# Altium project wootch_v_0_0.PrjPcb
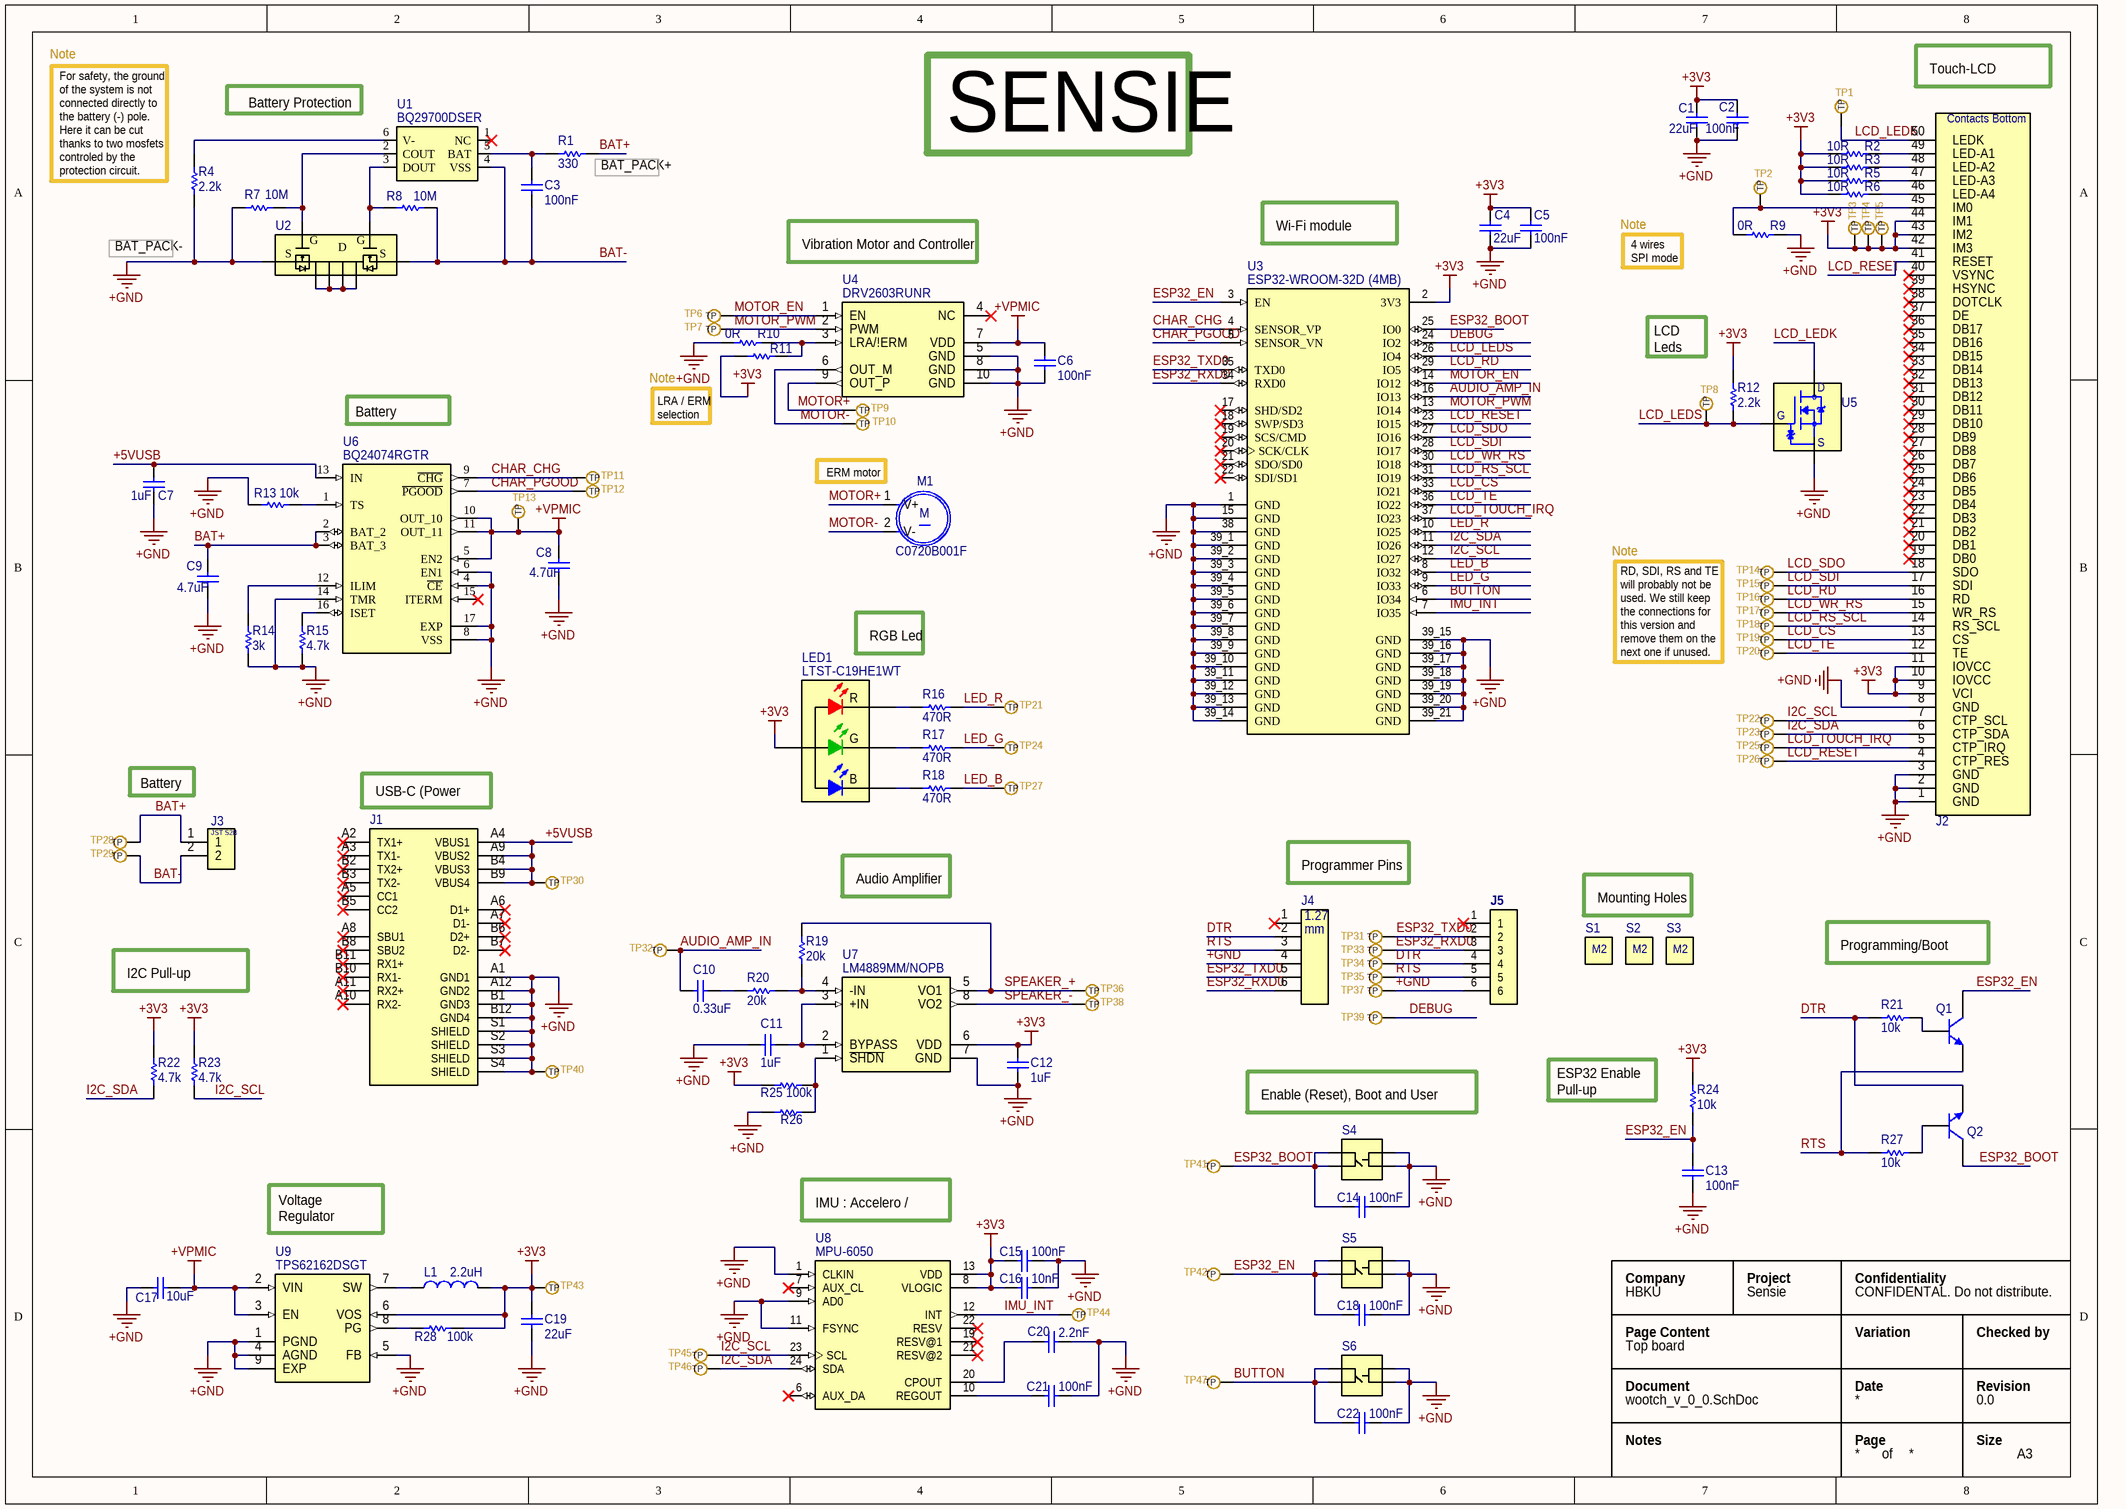
[diagram p0: wootch_v_0_0.SchDoc]
company: HBKU; page_size: A3; project: Sensie; version_revision: 0.0
1 sheet, 122 parts. Net scope: global (net labels, ports and power ports of the same name join across sheets).
Board file: wootch_v_0_0.PcbDoc

## Sheet wootch_v_0_0.SchDoc
size A3

### Parts
C1  value 22uF  [C0603]  (hidden comment: Multilayer Ceramic Capacitor)
C2  value 100nF  [C0402]  (hidden comment: Multilayer Ceramic Capacitor)
C3  value 100nF  [C0402]  (hidden comment: Multilayer Ceramic Capacitor)
C4  value 22uF  [C0603]  (hidden comment: Multilayer Ceramic Capacitor)
C5  value 100nF  [C0402]  (hidden comment: Multilayer Ceramic Capacitor)
C6  value 100nF  [C0402]  (hidden comment: Multilayer Ceramic Capacitor)
C7  value 1uF  [C0402]  (hidden comment: Multilayer Ceramic Capacitor)
C8  value 4.7uF  [C0402]  (hidden comment: Multilayer Ceramic Capacitor)
C9  value 4.7uF  [C0402]  (hidden comment: Multilayer Ceramic Capacitor)
C10  value 0.33uF  [C0402]  (hidden comment: Multilayer Ceramic Capacitor)
C11  value 1uF  [C0402]  (hidden comment: Multilayer Ceramic Capacitor)
C12  value 1uF  [C0402]  (hidden comment: Multilayer Ceramic Capacitor)
C13  value 100nF  [C0402]  (hidden comment: Multilayer Ceramic Capacitor)
C14  value 100nF  [C0402]  (hidden comment: Multilayer Ceramic Capacitor)
C15  value 100nF  [C0402]  (hidden comment: Multilayer Ceramic Capacitor)
C16  value 10nF  [C0402]  (hidden comment: Multilayer Ceramic Capacitor)
C17  value 10uF  [C0402]  (hidden comment: Multilayer Ceramic Capacitor)
C18  value 100nF  [C0402]  (hidden comment: Multilayer Ceramic Capacitor)
C19  value 22uF  [C0603]  (hidden comment: Multilayer Ceramic Capacitor)
C20  value 2.2nF  [C0402]  (hidden comment: Multilayer Ceramic Capacitor)
C21  value 100nF  [C0402]  (hidden comment: Multilayer Ceramic Capacitor)
C22  value 100nF  [C0402]  (hidden comment: Multilayer Ceramic Capacitor)
J1  1054500101  [USB-C-1054500101]  (value not drawn)
J2  FPC-50-screen-connector-bottom-62684-501100ALF  [FPC-50-62684-501100ALF]  (value not drawn)
J3  S2B-PH-K-S(LF)(SN)  [S2B-PH-K-S(LF)(SN)]  (value not drawn)
J4  FTS-103-01-F-DV-TR  [CON_6_2_1.27_FTS_103_01]  (value not drawn)
J5  Plug of Nails 6 pins  [PLUG-OF-NAILS-6-PIN]  (value not drawn)
L1  value 2.2uH  [L0603]  (hidden comment: IND 2.2uH 0603)
LED1  Manufacturer Part Number: LTST-C19HE1WT  [LTST-C19HE1WT-4_V]  (hidden comment: rgb_LTST-C19HE1WT)
M1  C0720B001F  [C0720B001F]
Q1  MMBT2222ALT1G  [ONSC-SOT-23-3-318-08_V]  (value not drawn)
Q2  MMBT2222ALT1G  [ONSC-SOT-23-3-318-08_V]  (value not drawn)
R1  value 330  [R0402]  (hidden comment: Thick Film)
R2  value 10R  [R0402]  (hidden comment: Thick Film)
R3  value 10R  [R0402]  (hidden comment: Thick Film)
R4  value 2.2k  [R0402]  (hidden comment: Thick Film)
R5  value 10R  [R0402]  (hidden comment: Thick Film)
R6  value 10R  [R0402]  (hidden comment: Thick Film)
R7  value 10M  [R0402]  (hidden comment: Thick Film)
R8  value 10M  [R0402]  (hidden comment: Thick Film)
R9  value 0R  [R0402]  (hidden comment: Thick Film)
R10  value 0R  [R0402]  (hidden comment: Thick Film)
R11  Thick Film  [R0402_DNI]  (value not drawn)
R12  value 2.2k  [R0402]  (hidden comment: Thick Film)
R13  value 10k  [R0402]  (hidden comment: Thick Film)
R14  value 3k  [R0402]  (hidden comment: Thick Film)
R15  value 4.7k  [R0402]  (hidden comment: Thick Film)
R16  value 470R  [R0402]  (hidden comment: Thick Film)
R17  value 470R  [R0402]  (hidden comment: Thick Film)
R18  value 470R  [R0402]  (hidden comment: Thick Film)
R19  value 20k  [R0402]  (hidden comment: Thick Film)
R20  value 20k  [R0402]  (hidden comment: Thick Film)
R21  value 10k  [R0402]  (hidden comment: Thick Film)
R22  value 4.7k  [R0402]  (hidden comment: Thick Film)
R23  value 4.7k  [R0402]  (hidden comment: Thick Film)
R24  value 10k  [R0402]  (hidden comment: Thick Film)
R25  value 100k  [R0402]  (hidden comment: Thick Film)
R26  Thick Film  [R0402_DNI]  (value not drawn)
R27  value 10k  [R0402]  (hidden comment: Thick Film)
R28  value 100k  [R0402]  (hidden comment: Thick Film)
S1  hole_M2  [M2_no_screw]  (value not drawn)
S2  hole_M2  [M2_no_screw]  (value not drawn)
S3  hole_M2  [M2_no_screw]  (value not drawn)
S4  TL1014BF160QG  [BUTTON_TL1014BF160QG]  (value not drawn)
S5  TL1014BF160QG  [BUTTON_TL1014BF160QG]  (value not drawn)
S6  TL1014BF160QG  [BUTTON_TL1014BF160QG]  (value not drawn)
TP1  TP_1mm  [TP_1mm]  (value not drawn)
TP2  TP_1mm  [TP_1mm]  (value not drawn)
TP3  TP_1mm  [TP_1mm]  (value not drawn)
TP4  TP_1mm  [TP_1mm]  (value not drawn)
TP5  TP_1mm  [TP_1mm]  (value not drawn)
TP6  TP_1mm  [TP_1mm]  (value not drawn)
TP7  TP_1mm  [TP_1mm]  (value not drawn)
TP8  TP_1mm  [TP_1mm]  (value not drawn)
TP9  TP_2mm  [TP_2mm]  (value not drawn)
TP10  TP_2mm  [TP_2mm]  (value not drawn)
TP11  TP_1mm  [TP_1mm]  (value not drawn)
TP12  TP_1mm  [TP_1mm]  (value not drawn)
TP13  TP_1mm  [TP_1mm]  (value not drawn)
TP14  TP_1mm  [TP_1mm]  (value not drawn)
TP15  TP_1mm  [TP_1mm]  (value not drawn)
TP16  TP_1mm  [TP_1mm]  (value not drawn)
TP17  TP_1mm  [TP_1mm]  (value not drawn)
TP18  TP_1mm  [TP_1mm]  (value not drawn)
TP19  TP_1mm  [TP_1mm]  (value not drawn)
TP20  TP_1mm  [TP_1mm]  (value not drawn)
TP21  TP_1mm  [TP_1mm]  (value not drawn)
TP22  TP_1mm  [TP_1mm]  (value not drawn)
TP23  TP_1mm  [TP_1mm]  (value not drawn)
TP24  TP_1mm  [TP_1mm]  (value not drawn)
TP25  TP_1mm  [TP_1mm]  (value not drawn)
TP26  TP_1mm  [TP_1mm]  (value not drawn)
TP27  TP_1mm  [TP_1mm]  (value not drawn)
TP28  TP_3mm  [TP_3mm]  (value not drawn)
TP29  TP_3mm  [TP_3mm]  (value not drawn)
TP30  TP_1mm  [TP_1mm]  (value not drawn)
TP31  TP_2mm  [TP_2mm]  (value not drawn)
TP32  TP_1mm  [TP_1mm]  (value not drawn)
TP33  TP_2mm  [TP_2mm]  (value not drawn)
TP34  TP_2mm  [TP_2mm]  (value not drawn)
TP35  TP_2mm  [TP_2mm]  (value not drawn)
TP36  TP_2mm  [TP_2mm]  (value not drawn)
TP37  TP_2mm  [TP_2mm]  (value not drawn)
TP38  TP_2mm  [TP_2mm]  (value not drawn)
TP39  TP_2mm  [TP_2mm]  (value not drawn)
TP40  TP_1mm  [TP_1mm]  (value not drawn)
TP41  TP_1mm  [TP_1mm]  (value not drawn)
TP42  TP_1mm  [TP_1mm]  (value not drawn)
TP43  TP_1mm  [TP_1mm]  (value not drawn)
TP44  TP_1mm  [TP_1mm]  (value not drawn)
TP45  TP_1mm  [TP_1mm]  (value not drawn)
TP46  TP_1mm  [TP_1mm]  (value not drawn)
TP47  TP_1mm  [TP_1mm]  (value not drawn)
U1  BQ29700DSER  [BATT_PROTEC_BQ29700DSER]
U2  ECH8693R-TL-W  [MOSFET_2CHAN_ECH8693R-TL-W]  (value not drawn)
U3  ESP32-WROOM-32D  [ESP32-WROOM-32D (4MB)]  (value not drawn)
U4  DRV2603RUNR  [MOT_DRV_DRV2603RUNR]
U5  DMG1012UW-7  [MOSFET-DMG1012UW-SOT323]  (value not drawn)
U6  BQ24074RGTR  [BATT_CHARG_BQ24074RGTR]
U7  Manufacturer Part Number: LM4889MM/NOPB  [Amp_LM4889MM]  (hidden comment: LM4889)
U8  MPU-6050  [MPU6050-ACCELERO-GYRO]
U9  TPS62162DSGT  [REG_BUCK_TPS62162DSGT]

### Nets
+3V3: C1.2 C2.2 C4.2 C5.2 C12.2 C15.1 C16.1 C19.2 J2.9(VCI) J2.10(IOVCC) J2.11(IOVCC) J2.42(IM3) J2.43(IM2) J2.44(IM1) L1.2 LED1.4(A) R2.1 R3.1 R5.1 R6.1 R11.1 R12.2 R22.2 R23.2 R24.2 R25.1 R28.2 TP3.1(TP) TP4.1(TP) TP5.1(TP) TP43.1(TP) U3.2(3V3) U7.6(VDD) U8.8(VLOGIC) U8.13(VDD) U9.6(VOS)
+GND: C1.1 C2.1 C4.1 C5.1 C6.1 C7.1 C8.1 C9.1 C11.2 C12.1 C13.1 C14.2 C15.2 C16.2 C17.1 C18.2 C19.1 C20.2 C21.2 C22.2 J1.A1(GND1) J1.A12(GND2) J1.B1(GND3) J1.B12(GND4) J1.S1(SHIELD) J1.S2(SHIELD) J1.S3(SHIELD) J1.S4(SHIELD) J2.1(GND) J2.2(GND) J2.3(GND) J2.8(GND) J4.4 J5.6 R4.1 R7.2 R9.2 R10.1 R13.2 R14.1 R15.1 R26.1 S4.1 S4.3 S5.1 S5.3 S6.1 S6.3 TP37.1(TP) TP40.1(TP) U2.1(S1) U3.1(GND) U3.15(GND) U3.38(GND) U3.39_1(GND) U3.39_2(GND) U3.39_3(GND) U3.39_4(GND) U3.39_5(GND) U3.39_6(GND) U3.39_7(GND) U3.39_8(GND) U3.39_9(GND) U3.39_10(GND) U3.39_11(GND) U3.39_12(GND) U3.39_13(GND) U3.39_14(GND) U3.39_15(GND) U3.39_16(GND) U3.39_17(GND) U3.39_18(GND) U3.39_19(GND) U3.39_20(GND) U3.39_21(GND) U4.5(GND) U4.8(GND) U4.10(GND) U5.3(S) U6.4(~{CE}) U6.6(EN1) U6.8(VSS) U6.14(TMR) U6.17(EXP) U7.7(GND) U8.1(CLKIN) U8.9(AD0) U8.11(FSYNC) U9.1(PGND) U9.4(AGND) U9.5(FB) U9.9(EXP)
+VPMIC: C6.2 C8.2 C17.2 TP13.1(TP) U4.7(VDD) U6.5(EN2) U6.10(OUT_10) U6.11(OUT_11) U9.2(VIN) U9.3(EN)
+5VUSB: C7.2 J1.A4(VBUS1) J1.A9(VBUS2) J1.B4(VBUS3) J1.B9(VBUS4) TP30.1(TP) U6.13(IN)
AUDIO_AMP_IN: C10.1 TP32.1(TP) U3.16(IO13)
BAT+: C9.2 J3.1 R1.2 TP28.1(TP) U6.2(BAT_2) U6.3(BAT_3)
BAT-: C3.1 J3.2 R8.1 TP29.1(TP) U1.4(VSS) U2.3(S2)
BUTTON: C22.1 S6.2 S6.4 TP47.1(TP) U3.6(IO34)
CHAR_CHG: TP11.1(TP) U3.4(SENSOR_VP) U6.9(~{CHG})
CHAR_PGOOD: TP12.1(TP) U3.5(SENSOR_VN) U6.7(~{PGOOD})
DEBUG: TP39.1(TP) U3.24(IO2)
DTR: J4.2 J5.4 Q2.2(E) R21.1 TP34.1(TP)
ESP32_BOOT: C14.1 Q2.3(C) S4.2 S4.4 TP41.1(TP) U3.25(IO0)
ESP32_EN: C13.2 C18.1 Q1.3(C) R24.1 S5.2 S5.4 TP42.1(TP) U3.3(EN)
ESP32_RXD0: J4.6 J5.3 TP33.1(TP) U3.34(RXD0)
ESP32_TXD0: J4.5 J5.2 TP31.1(TP) U3.35(TXD0)
I2C_SCL: J2.7(CTP_SCL) R23.1 TP22.1(TP) TP45.1(TP) U3.12(IO27) U8.23(SCL)
I2C_SDA: J2.6(CTP_SDA) R22.1 TP23.1(TP) TP46.1(TP) U3.11(IO26) U8.24(SDA)
IMU_INT: TP44.1(TP) U3.7(IO35) U8.12(INT)
LCD_CS: J2.13(CS) TP19.1(TP) U3.33(IO21)
LCD_LEDK: J2.50(LEDK) TP1.1(TP) U5.1(D)
LCD_LEDS: R12.1 TP8.1(TP) U3.26(IO4) U5.2(G)
LCD_RD: J2.16(RD) TP16.1(TP) U3.29(IO5)
LCD_RESET: J2.4(CTP_RES) J2.41(RESET) TP26.1(TP) U3.23(IO15)
LCD_RS_SCL: J2.14(RS_SCL) TP18.1(TP) U3.31(IO19)
LCD_SDI: J2.17(SDI) TP15.1(TP) U3.28(IO17)
LCD_SDO: J2.18(SDO) TP14.1(TP) U3.27(IO16)
LCD_TE: J2.12(TE) TP20.1(TP) U3.36(IO22)
LCD_TOUCH_IRQ: J2.5(CTP_IRQ) TP25.1(TP) U3.37(IO23)
LCD_WR_RS: J2.15(WR_RS) TP17.1(TP) U3.30(IO18)
LED_B: R18.2 TP27.1(TP) U3.8(IO32)
LED_G: R17.2 TP24.1(TP) U3.9(IO33)
LED_R: R16.2 TP21.1(TP) U3.10(IO25)
MOTOR+: M1.1(V+) TP9.1(TP) U4.9(OUT_P)
MOTOR-: M1.2(V-) TP10.1(TP) U4.6(OUT_M)
MOTOR_EN: TP6.1(TP) U3.14(IO12) U4.1(EN)
MOTOR_PWM: TP7.1(TP) U3.13(IO14) U4.2(PWM)
RTS: J4.3 J5.5 Q1.2(E) R27.1 TP35.1(TP)
SPEAKER_+: R19.2 TP36.1(TP) U7.5(VO1)
SPEAKER_-: TP38.1(TP) U7.8(VO2)
NetC3_2: C3.2 R1.1 U1.5(BAT)
NetC10_2: C10.2 R20.1
NetC11_1: C11.1 U7.2(BYPASS) U7.3(+IN)
NetC20_1: C20.1 U8.20(CPOUT)
NetC21_1: C21.1 U8.10(REGOUT)
NetJ2_45: J2.45(IM0) R9.1 TP2.1(TP)
NetJ2_46: J2.46(LED-A4) R6.2
NetJ2_47: J2.47(LED-A3) R5.2
NetJ2_48: J2.48(LED-A2) R3.2
NetJ2_49: J2.49(LED-A1) R2.2
NetL1_1: L1.1 U9.7(SW)
NetLED1_1: LED1.1(R) R16.1
NetLED1_2: LED1.2(G) R17.1
NetLED1_3: LED1.3(B) R18.1
NetQ1_1: Q1.1(B) R21.2
NetQ2_1: Q2.1(B) R27.2
NetR4_2: R4.2 U1.6(V-)
NetR7_1: R7.1 U1.2(COUT) U2.2(G1)
NetR8_2: R8.2 U1.3(DOUT) U2.4(G2)
NetR10_2: R10.2 R11.2 U4.3(LRA/!ERM)
NetR13_1: R13.1 U6.1(TS)
NetR14_2: R14.2 U6.12(ILIM)
NetR15_2: R15.2 U6.16(ISET)
NetR19_1: R19.1 R20.2 U7.4(-IN)
NetR25_2: R25.2 R26.2 U7.1(~{SHDN})
NetR28_1: R28.1 U9.8(PG)
NetU2_5: U2.5(D) U2.6(D) U2.7(D) U2.8(D)

Not connected (* = marked no-connect by the designer): J1 A2(TX1+)* A3(TX1-)* A5(CC1)* A6(D1+)* A7(D1-)* A8(SBU1)* A10(RX2-)* A11(RX2+)* B2(TX2+)* B3(TX2-)* B5(CC2)* B6(D2+)* B7(D2-)* B8(SBU2)* B10(RX1-)* B11(RX1+)*; J2 19(DB0)* 20(DB1)* 21(DB2)* 22(DB3)* 23(DB4)* 24(DB5)* 25(DB6)* 26(DB7)* 27(DB8)* 28(DB9)* 29(DB10)* 30(DB11)* 31(DB12)* 32(DB13)* 33(DB14)* 34(DB15)* 35(DB16)* 36(DB17)* 37(DE)* 38(DOTCLK)* 39(HSYNC)* 40(VSYNC)*; J4 1*; J5 1*; U1 1(NC)*; U3 17(SHD/SD2)* 18(SWP/SD3)* 19(SCS/CMD)* 20(SCK/CLK)* 21(SDO/SD0)* 22(SDI/SD1)*; U4 4(NC)*; U6 15(ITERM)*; U8 6(AUX_DA)* 7(AUX_CL)* 19(RESV@1)* 21(RESV@2)* 22(RESV)*

### Notes on the sheet
- Note
- Battery Protection
- Touch-LCD connector
- (near R4) For safety, the ground of the system is not connected directly to the battery (-) pole. Here it can be cut thanks to two mosfets controled by the protection circuit.
- (near R1) BAT_PACK+
- SENSIE
- Vibration Motor and Controller
- Wi-Fi module ESP32
- BAT_PACK-
- 4 wires
  SPI mode
- LCD Leds
  Driver
- Battery Charger
- LRA / ERM selection
- ERM motor
- RGB Led
- RD, SDI, RS and TE will probably not be used. We still keep the connections for this version and remove them on the next one if unused.
- Battery
- (near J1) USB-C (Power Only)
- Audio Amplifier
- Programmer Pins
- Mounting Holes
- I2C Pull-up Resistors
- Programming/Boot Logic
- Enable (Reset), Boot and User Buttons
- (near R24) ESP32 Enable
  Pull-up Resistors
- Voltage Regulator
  3.3V BUCK
- IMU : Accelero / Gyro
- Company
- Project
- CONFIDENTAL. Do not distribute.
- Confidentiality
- Page Content
- Document
- Top board
- Variation
- Date
- Checked by
- Revision
- Notes
- Page
- of
- Size
- (in symbol C0720B001F) M
- (in symbol ECH8693R-TL-W) G; S
- (in symbol FPC-50-screen-connector-bottom-62684-501100ALF) Contacts Bottom
- (in symbol FTS-103-01-F-DV-TR) 1.27; mm
- (in symbol hole_M2) M2
- (in symbol S2B-PH-K-S(LF)(SN)) JST S2B

### Library data of the parts
C1 C4 C19 = CAP 22uF 0603: CAP CER 22UF 6.3V X5R 0603; Manufacturer Part Number: GRM188R60J226MEA0D; Manufacturer: Murata Electronics; Supplier Part Number: 490-7611-1-ND; Voltage Rating: 6.3V; Package: 0603; Link: https://www.digikey.com/product-detail/en/murata-electronics/GRM188R60J226MEA0D/490-7611-1-ND/4280544; Supplier: Digikey
C2 C3 C5 C6 C13-C15 C18 C21 C22 = CAP 100nF 0402: CAP CER 0.1UF 16V X7R 0402; Manufacturer Part Number: GRM155R71C104KA88J; Manufacturer: Murata Electronics; Supplier Part Number: 490-6328-1-ND; Voltage Rating: 16V; Package: 0402; Link: https://www.digikey.com/product-detail/en/murata-electronics/GRM155R71C104KA88J/490-6328-1-ND/3845525; Supplier: Digikey
C7 C11 C12 = CAP 1uF 0402: CAP CER 1UF 10V X6S 0402; Manufacturer Part Number: GRM155C81A105KA12D; Manufacturer: Murata Electronics; Supplier Part Number: 490-12699-1-ND; Voltage Rating: 10V; Package: 0402; Link: https://www.digikey.com/product-detail/en/murata-electronics/GRM155C81A105KA12D/490-12699-1-ND/5797668; Supplier: Digikey
C8 C9 = CAP 4.7uF 0402: CAP CER 4.7UF 6.3V X5R 0402; Manufacturer Part Number: GRM155R60J475ME47D; Manufacturer: Murata Electronics; Supplier Part Number: 490-5915-1-ND; Voltage Rating: 6.3V; Package: 0402; Link: https://www.digikey.com/product-detail/en/murata-electronics/GRM155R60J475ME47D/490-5915-1-ND/3719860; Supplier: Digikey
C10 = CAP 0.33uF 0402: CAP CER 0.33UF 10V X6S 0402; Manufacturer Part Number: GRM155R61A334KE15D; Manufacturer: Murata Electronics; Supplier Part Number: 490-3263-1-ND; Voltage Rating: 10V; Package: 0402; Link: https://www.digikey.com/en/products/detail/murata-electronics/GRM155R61A334KE15D/702527; Supplier: Digikey
C16 = CAP 10nF 0402: CAP CER 10nF 16V X7R 0402; Manufacturer Part Number: GCM155R71H103KA55D; Manufacturer: Murata Electronics; Supplier Part Number: 490-4762-1-ND; Voltage Rating: 16V; Package: 0402; Link: https://www.digikey.com/en/products/detail/murata-electronics/GCM155R71H103KA55D/1641636; Supplier: Digikey
C17 = CAP 10uF 0402: CAP CER 10UF 4V X5R 0402; Manufacturer Part Number: GRM155R60G106ME44D; Manufacturer: Murata Electronics; Supplier Part Number: 490-10693-1-ND; Voltage Rating: 4V; Package: 0402; Link: https://www.digikey.com/product-detail/en/murata-electronics/GRM155R60G106ME44D/490-10693-1-ND/5251412; Supplier: Digikey
C20 = CAP 2.2nF 0402: CAP CER 2.2nF 16V X7R 0402; Manufacturer Part Number: GCM155R72A222KA37D; Manufacturer: Murata Electronics; Supplier Part Number: 490-4911-1-ND; Voltage Rating: 16V; Package: 0402; Link: https://www.digikey.com/en/products/detail/murata-electronics/GCM155R72A222KA37D/1765159; Supplier: Digikey
J1 = 1054500101: USB-C CONN RCP USB3.1 TYPEC 24P SMD RA; Manufacturer: Molex; zz Current Rating Per Pin: 0.25A, 1A, 5A; Supplier Part Number: WM12856CT-ND; Link: https://www.digikey.com/en/products/detail/molex/1054500101/5843890; Manufacturer Part Number: 1054500101; Supplier: Digikey; Price 1000+ Units USD: 2.19; Price 1 Unit USD: 1.10
J2 = FPC-50-screen-connector-bottom-62684-501100ALF: FPC CONN BOTTOM 50POS 0.50MM R/A; Manufacturer: Amphenol ICC (FCI); zz Current Rating Per Pin: 0.5A; Supplier Part Number: 609-1197-1-ND; Link: https://www.digikey.com/en/products/detail/amphenol-icc-fci/62684-501100ALF/1001511; Manufacturer Part Number: 62684-501100ALF; Supplier: Digikey; Price 1000+ Units USD: 0.48; Price 1 Unit USD: 0.88
J3 = S2B-PH-K-S(LF)(SN): JST 2mm CONN HEADER R/A 2POS; Manufacturer: JST Sales America Inc.; Supplier Part Number: 455-1719-ND; Link: https://www.digikey.com/en/products/detail/jst-sales-america-inc/S2B-PH-K-S-LF-SN/926626; Manufacturer Part Number: S2B-PH-K-S(LF)(SN); Supplier: Digikey; Price 1000+ Units USD: 0.07; Price 1 Unit USD: 0.17
J4 = FTS-103-01-F-DV-TR: CONN HEADER SMD 6POS 1.27MM; Manufacturer: Samtec Inc.; zz Current Rating Per Pin: 3.4A; Supplier Part Number: SAM14930CT-ND; Link: https://www.digikey.com/en/products/detail/samtec-inc/FTS-103-01-F-DV-TR/2649936; Manufacturer Part Number: FTS-103-01-F-DV-TR; Supplier: Digikey; Price 1000+ Units USD: 0.78; Price 1 Unit USD: 1.39
J5 = Plug of Nails 6 pins: CBL PLUG-OF-NAILS 6-PIN with NO ATTACHMENT holes (contrary to the digikey link); Manufacturer: Tag-Connect LLC; Manufacturer Part Number: TC2030-CTX; Link: https://www.digikey.co.uk/product-detail/en/tag-connect-llc/TC2030-CTX/TC2030-CTX-ND/5023324; Supplier Part Number: TC2030-CTX-ND; Supplier: Digikey; Price 1000+ Units USD: 0; Price 1 Unit USD: 0
L1 = IND 2.2uH 0603: 2.2UH20% 1.05A(MAX) / 1.15A(TYP.; Manufacturer: Murata Electronics; Manufacturer Part Number: LQM18PN2R2MGHD; Tolerance: 20%; Supplier Part Number: 490-14478-6-ND; Package: 0603; Link: https://www.digikey.co.uk/product-detail/en/murata-electronics/LQM18PN2R2MGHD/490-14478-6-ND/6607082; Supplier: Digikey
LED1 = rgb_LTST-C19HE1WT: LED RGB DIFFUSED CHIP SMD / LED Tri-Color Blue/Green/Red, 5 V, -20 to 80 degC, 4-Pin SMD, RoHS, Tape and Reel; Manufacturer: Lite-On Inc.; zz Package: 0606; zz Power Supply Rating: 2.1V Red, 3.35V Green, 3.35V Blue; Supplier: Digikey; Link: https://www.digikey.com/product-detail/en/lite-on-inc/LTST-C19HE1WT/160-2162-1-ND/4866310; Price 1 Unit USD: 0.56; Price 1000+ Units USD: 0.13; Supplier Part Number: 160-2162-1-ND
M1 = C0720B001F: DC Motor Vibration, ERM 10000 RPM   3VDC; Manufacturer: Jinlong Machinery & Electronics, Inc.; ComponentLink1Description: Manufacturer URL; ComponentLink2Description: Datasheet; Link: https://www.digikey.com/en/products/detail/jinlong-machinery-electronics-inc/C0720B001F/6009905; Supplier Part Number: Jinlong Machinery & Electronics, Inc.; Supplier: Digikey; Price 1000+ Units USD: 2.30; Price 1 Unit USD: 3.50; Manufacturer Part Number: C0720B001F
Q1 Q2 = MMBT2222ALT1G: TRANS NPN 40V 0.6A SOT23 / General Purpose Transistor, NPN Silicon, 3-Pin SOT-23, Pb-Free, Tape and Reel; Manufacturer: ON Semiconductor; ComponentLink3URL: http://www.onsemi.cn/pub_link/Collateral/318-08.PDF; ComponentLink1URL: http://www.onsemi.com/; ComponentLink3Description: Package Specification; ComponentLink2Description: Datasheet; ComponentLink2URL: http://www.onsemi.cn/pub_link/Collateral/MMBT2222LT1-D.PDF; ComponentLink1Description: Manufacturer URL; Supplier: Digikey; Price 1000+ Units USD: 0.02; Supplier Part Number: MMBT2222ALT1GOSCT-ND; Price 1 Unit USD: 0.15; Manufacturer Part Number: MMBT2222ALT1G; Link: https://www.digikey.co.uk/product-detail/en/on-semiconductor/MMBT2222ALT1G/MMBT2222ALT1GOSCT-ND/1139806
R1 = RES 330R 0402: RES SMD 330 OHM 1% 1/16W 0402; Manufacturer: Yageo; Manufacturer Part Number: RC0402FR-07330RL; Supplier Part Number: 311-330LRCT-ND; Tolerance: 1%; Package: 0402; Power: 1/16W; Link: https://www.digikey.co.uk/product-detail/en/yageo/RC0402FR-07330RL/311-330LRCT-ND/729541; Supplier: Digikey
R2 R3 R5 R6 = RES 10R 0402: RES SMD 10 OHM 1% 1/16W 0402; Manufacturer: Yageo; Manufacturer Part Number: RC0402FR-0710RL; Supplier Part Number: 311-10.0LRCT-ND; Tolerance: 1%; Package: 0402; Power: 1/16W; Link: https://www.digikey.co.uk/product-detail/en/yageo/RC0402FR-0710RL/311-10-0LRCT-ND/729471; Supplier: Digikey
R4 R12 = RES 2.2k 0402: RES SMD 2.2K OHM 1% 1/16W 0402; Manufacturer: Yageo; Manufacturer Part Number: RC0402FR-072K2L; Supplier Part Number: 311-2.20KLRCT-ND; Tolerance: 1%; Package: 0402; Power: 1/16W; Link: https://www.digikey.co.uk/product-detail/en/yageo/RC0402FR-072K2L/311-2-20KLRCT-ND/729500; Supplier: Digikey
R7 R8 = RES 10M 0402: RES SMD 10 MOHM 1% 1/16W 0402; Manufacturer: Yageo; Manufacturer Part Number: RC0402FR-0710ML; Supplier Part Number: 311-10.0MLRCT-ND; Tolerance: 1%; Package: 0402; Power: 1/16W; Link: https://www.digikey.co.uk/product-detail/en/yageo/RC0402FR-0710ML/311-10-0MLRCT-ND/2827890; Supplier: Digikey
R9 R10 = RES 0R 0402: RES SMD 0 OHM JUMPER 1/16W 0402; Manufacturer: Yageo; Manufacturer Part Number: RC0402JR-070RL; Tolerance: 1%; Supplier Part Number: 311-0.0JRCT-ND; Package: 0402; Power: 1/16W; Link: https://www.digikey.com/product-detail/en/yageo/RC0402JR-070RL/311-0-0JRCT-ND/729353; Supplier: Digikey
R11 R26 = RES DNI 0402: DNI (Do Not Install)
R13 R21 R24 R27 = RES 10k 0402: RES SMD 10K OHM 1% 1/16W 0402; Manufacturer: Yageo; Manufacturer Part Number: RC0402FR-0710KL; Supplier Part Number: 311-10.0KLRCT-ND; Tolerance: 1%; Package: 0402; Power: 1/16W; Link: https://www.digikey.com/product-detail/en/yageo/RC0402FR-0710KL/311-10-0KLRCT-ND/729470; Supplier: Digikey
R14 = RES 3k 0402: RES SMD 10K OHM 1% 1/16W 0402; Manufacturer: Yageo; Manufacturer Part Number: RC0402FR-073KL; Supplier Part Number: 311-3KLRCT-ND; Tolerance: 1%; Package: 0402; Power: 1/16W; Link: https://www.digikey.co.uk/product-detail/en/yageo/RC0402FR-073KL/311-3KLRCT-ND/2827904; Supplier: Digikey
R15 R22 R23 = RES 4.7k 0402: RES SMD 4.7K OHM 1% 1/16W 0402; Manufacturer: Yageo; Manufacturer Part Number: RT0402FRE074K7L; Supplier Part Number: YAG3347CT-ND; Tolerance: 1%; Power: 1/16W; Link: https://www.digikey.co.uk/product-detail/en/yageo/RT0402FRE074K7L/YAG3347CT-ND/5418052; Supplier: Digikey
R16-R18 = RES 470R 0402: RES SMD 470 OHM 1% 1/16W 0402; Manufacturer: Yageo; Manufacturer Part Number: RC0402FR-07470RL; Supplier Part Number: 311-470LRCT-ND; Tolerance: 1%; Package: 0402; Power: 1/16W; Link: https://www.digikey.com/product-detail/en/yageo/RC0402FR-07470RL/311-470LRCT-ND/729566; Supplier: Digikey
R19 R20 = RES 20k 0402: RES SMD 20K OHM 1% 1/16W 0402; Manufacturer: Yageo; Manufacturer Part Number: RC0402FR-0720KL; Supplier Part Number: 311-20.0KLRCT-ND; Tolerance: 1%; Power: 1/16W; Link: https://www.digikey.co.uk/product-detail/en/yageo/RC0402FR-0720KL/311-20-0KLRCT-ND/729504; Supplier: Digikey
R25 R28 = RES 100k 0402: RES SMD 100K OHM 1% 1/16W 0402; Manufacturer: Yageo; Manufacturer Part Number: RC0402FR-07100KL; Supplier Part Number: 311-100KLRCT-ND; Tolerance: 1%; Power: 1/16W; Link: https://www.digikey.co.uk/product-detail/en/yageo/RC0402FR-07100KL/311-100KLRCT-ND/729473; Supplier: Digikey
S1-S3 = hole_M2: Mounting hole  M2 size, no solder stop, so no screw
S4-S6 = TL1014BF160QG: SWITCH TACTILE SPST-NO 0.05A 12V; Manufacturer: E-Switch; ComponentLink1Description: Manufacturer URL; ComponentLink2URL: http://spec_sheets.e-switch.com/specs/P410002.pdf; ComponentLink2Description: Datasheet; Link: https://www.digikey.com/product-detail/en/e-switch/TL1014BF160QG/EG5042CT-ND/3910808; Supplier Part Number: EG5042CT-ND; Supplier: Digikey; Price 1000+ Units USD: 0.40; Price 1 Unit USD: 0.65; Manufacturer Part Number: TL1014BF160QG
TP1-TP8 TP11-TP27 TP30 TP32 TP40-TP47 = TP_1mm: Test point 1mm diameter; ComponentLink1Description: Manufacturer URL; ComponentLink2Description: Datasheet; Supplier: Digikey
TP9 TP10 TP31 TP33-TP39 = TP_2mm: Test point 2mm diameter; ComponentLink1Description: Manufacturer URL; ComponentLink2Description: Datasheet; Supplier: Digikey
TP28 TP29 = TP_3mm: Test point 2mm diameter; ComponentLink1Description: Manufacturer URL; ComponentLink2Description: Datasheet; Supplier: Digikey
U1 = BQ29700DSER: BATT LITHIUM BATT PROTECT 6-SON; Manufacturer: Texas Instruments; ComponentLink1Description: Manufacturer URL; ComponentLink2Description: Datasheet; Link: https://www.digikey.com/product-detail/en/texas-instruments/BQ29700DSER/296-43985-1-ND/5973209; Supplier Part Number: 296-43985-1-ND; Supplier: Digikey; Price 1000+ Units USD: 0.21; Price 1 Unit USD: 0.56; Manufacturer Part Number: BQ29700DSER
U2 = ECH8693R-TL-W: MOSFET 2N-CH 24V 14A SOT-28; Manufacturer: ON Semiconductor; ComponentLink1Description: Manufacturer URL; ComponentLink2Description: Datasheet; Link: https://www.digikey.com/product-detail/en/on-semiconductor/ECH8693R-TL-W/ECH8693R-TL-WOSCT-ND/5969317; Supplier Part Number: ECH8693R-TL-WOSCT-ND; Supplier: Digikey; Price 1000+ Units USD: 0.53; Price 1 Unit USD: 0.20; Manufacturer Part Number: ECH8693R-TL-W
U3 = ESP32-WROOM-32D: ESP32-WROOM-32D Wifi/Bluetooth Module; Manufacturer: Espressif Systems; ComponentLink1Description: Manufacturer URL; ComponentLink2Description: Datasheet; Link: https://www.digikey.com/en/products/detail/espressif-systems/ESP32-WROOM-32D-4MB/9381716; Supplier Part Number: 1965-ESP32-WROOM-32D(4MB)CT-ND; Supplier: Digikey; Price 1000+ Units USD: 3.8; Price 1 Unit USD: 2.4; Manufacturer Part Number: ESP32-WROOM-32D (4MB)
U4 = DRV2603RUNR: MOTOR DRIVER 2.5V-5.2V 10QFN; Manufacturer: Texas Instruments; ComponentLink1Description: Manufacturer URL; ComponentLink2Description: Datasheet; Link: https://www.digikey.com/product-detail/en/texas-instruments/DRV2603RUNR/296-30613-1-ND/3487222; Supplier Part Number: 296-30613-1-ND; Supplier: Digikey; Price 1000+ Units USD: 0.55; Price 1 Unit USD: 1.31; Manufacturer Part Number: DRV2603RUNR
U5 = DMG1012UW-7: MOSFET Logi level N-CH 20V 1A SOT323; Manufacturer: Diodes Incorporated; ComponentLink1Description: Manufacturer URL; ComponentLink2Description: Datasheet; Link: https://www.digikey.com/en/products/detail/diodes-incorporated/DMG1012UW-7/2183239; Supplier Part Number: DMG1012UW-7DICT-ND; Supplier: Digikey; Price 1000+ Units USD: 0.05; Price 1 Unit USD: 0.33; Manufacturer Part Number: DMG1012UW-7
U6 = BQ24074RGTR: BATT LI-ION CHARGE MGMT 16-QFN; Manufacturer: Texas Instruments; ComponentLink1Description: Manufacturer URL; ComponentLink2Description: Datasheet; Link: https://www.digikey.com/product-detail/en/texas-instruments/BQ24074RGTR/296-38873-1-ND/5142985; Supplier Part Number: 296-38873-1-ND; Supplier: Digikey; Price 1000+ Units USD: 1.01; Price 1 Unit USD: 2.21; Manufacturer Part Number: BQ24074RGTR
U7 = LM4889: IC AMP CLASS AB MONO 1W 8VSSOP; Manufacturer: Texas Instruments; ComponentLink1Description: Manufacturer URL; ComponentLink2Description: Datasheet; Link: https://www.digikey.com/en/products/detail/texas-instruments/LM4889MM-NOPB/947616; Supplier Part Number: LM4889MM/NOPBCT-ND; Supplier: Digikey; Price 1000+ Units USD: 0.71; Price 1 Unit USD: 1.31
U8 = MPU-6050: IMU ACCEL/GYRO 3-AXIS I2C 24QFN; Manufacturer: TDK InvenSense; ComponentLink1Description: Manufacturer URL; ComponentLink2Description: Datasheet; Link: https://www.digikey.com/en/products/detail/tdk-invensense/MPU-6050/4038009; Supplier Part Number: 1428-1007-1-ND; Supplier: Digikey; Price 1000+ Units USD: 3.70; Price 1 Unit USD: 7.55; Manufacturer Part Number: MPU-6050
U9 = TPS62162DSGT: IC REG BUCK 3.3V 1A 8WSON; Manufacturer: Texas Instruments; ComponentLink1Description: Manufacturer URL; ComponentLink2Description: Datasheet; Link: https://www.digikey.co.uk/product-detail/en/texas-instruments/TPS62162DSGT/296-29897-1-ND/2782627; Supplier Part Number: 296-29897-1-ND; Supplier: Digikey; Price 1000+ Units USD: 0.53; Price 1 Unit USD: 1.40; Manufacturer Part Number: TPS62162DSGT